# Altium schematic sheet USB_OTG.SchDoc: USB OTG
size Letter; Engineer: Nathan Petersen; DocumentNumber: 27; Revision: v1.2; SheetNumber: 27; SheetTotal: 29
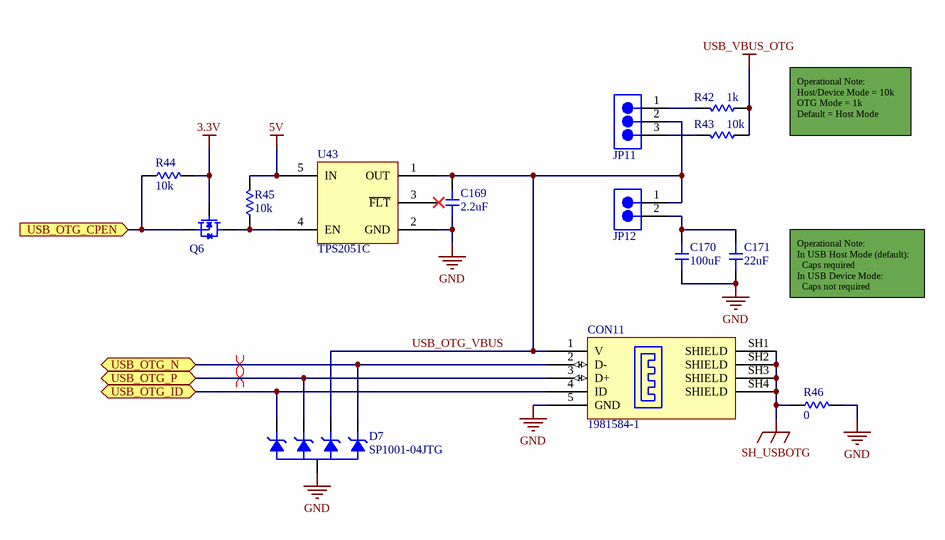
[diagram p0: USB_OTG.SchDoc]

## Parts
C169  value 2.2uF  [0603-CAP]  (hidden comment: Capacitor)
C170  value 100uF  [1812-CAP]  (hidden comment: Capacitor)
C171  value 22uF  [0603-CAP]  (hidden comment: Capacitor)
CON11  1981584-1  [1981584-1]
D7  SP1001-04JTG  [SC70-5]
JP11  Jumper3  [PIN_HEADER_1X3]  (value not drawn)
JP12  Jumper2  [PIN_HEADER_1x2]  (value not drawn)
Q6  MOSFET  [SOT95P250-3N]  (value not drawn)
R42  value 1k  [0603-RES]  (hidden comment: Resistor)
R43  value 10k  [0603-RES]  (hidden comment: Resistor)
R44  value 10k  [0603-RES]  (hidden comment: Resistor)
R45  value 10k  [0603-RES]  (hidden comment: Resistor)
R46  value 0  [0603-RES]  (hidden comment: Resistor)
U43  TPS2051C  [SOT23-5]

## Ports
USB_OTG_CPEN (in), USB_OTG_ID (bidir), USB_OTG_N (bidir), USB_OTG_P (bidir)

## Nets
3.3V: Q6.1(G) R44.2
5V: R45.2 U43.5(IN)
GND: C169.1 C170.1 C171.1 CON11.5(GND) D7.2(A) R46.2 U43.2(GND)
SH_USBOTG: CON11.SH1(SHIELD) CON11.SH2(SHIELD) CON11.SH3(SHIELD) CON11.SH4(SHIELD) R46.1
USB_VBUS_OTG: R42.1 R43.1
USB_OTG_CPEN: Q6.2(S) R44.1 ; port USB_OTG_CPEN
USB_OTG_ID: CON11.4(ID) D7.1(C1) ; port USB_OTG_ID
USB_OTG_N: CON11.2(D-) D7.4(C4) ; port USB_OTG_N
USB_OTG_P: CON11.3(D+) D7.5(C2) ; port USB_OTG_P
USB_OTG_VBUS: C169.2 CON11.1(V) D7.3(C3) JP11.2 JP12.1 U43.1(OUT)
NetC170_2: C170.2 C171.2 JP12.2
NetJP11_1: JP11.1 R42.2
NetJP11_3: JP11.3 R43.2
NetQ6_3: Q6.3(D) R45.1 U43.4(EN)

Not connected (* = marked no-connect by the designer): U43 3(~{FLT})*

## Layout directives
differential pair: USB_OTG_N, USB_OTG_P

## Notes on the sheet
- Operational Note:
  Host/Device Mode = 10k
  OTG Mode = 1k
  Default = Host Mode
- Operational Note:
  In USB Host Mode (default):
  Caps required
  In USB Device Mode:
  Caps not required
- Title:
- File:
- Sheet:
- of
- Revision:
- Time:
- Date:
- Engineer:

## Library data of the parts
C169 = Capacitor: Manufacturer: Murata; Manufacturer Part Number: GRM188R6YA225MA12D; Voltage Rating: 35V; Tolerance: 20%; Dielectric: X5R; Supplier 1: Digi-Key; Supplier Part Number 1: 490-10486-6-ND; Stock 1: 30635; Pricing 1: 1=0.21, 10=0.142, 100=0.0721, 500=0.04934, 1000=0.04364 (USD); Mount: Surface Mount; Case/Package: 0603; Weight: 0.000222oz; Case Code (Metric): 1608; Case Code (Imperial): 0603; Min Operating Temperature: -55°C; Max Operating Temperature: 85°C; Capacitance: 2.2uF; Packaging: Tape and Reel; Termination: SMD/SMT; Voltage Rating (DC): 35V; Package Quantity: 4000; Length: 0.063inch; Height: 0.8mm; Width: 0.031inch; Thickness: 0.035inch; ComponentLink1URL: http://search.murata.co.jp/Ceramy/image/img/A01X/G101/ENG/GRM188R6YA225MA12-01.pdf; ComponentLink1Description: http://search.murata.co.jp/Ceramy/image/img/A01X/G101/ENG/GRM188R6YA225MA12-01.pdf; ComponentLink2URL: http://search.murata.co.jp/Ceramy/image/img/A01X/partnumbering_e_01.pdf; ComponentLink2Description: http://search.murata.co.jp/Ceramy/image/img/A01X/partnumbering_e_01.pdf; ComponentLink3URL: http://www.mouser.com/ds/2/281/c02e-2905.pdf; ComponentLink3Description: http://www.mouser.com/ds/2/281/c02e-2905.pdf
C170 = Capacitor: Manufacturer: TDK; Manufacturer Part Number: C4532X5R1A107M280KC; Dielectric Material: Ceramic; Tolerance: 20%; Voltage Rating: 10V; Dielectric: X5R; Supplier 1: Digi-Key; Supplier Part Number 1: 445-7743-6-ND; Stock 1: 5000; Pricing 1: 1=2.2, 10=1.779, 100=1.3584 (USD); Mount: Surface Mount; Case/Package: 1812; Number of Pins: 2; Weight: 0.000952oz; Case Code (Metric): 4532; Case Code (Imperial): 1812; Min Operating Temperature: -55°C; Max Operating Temperature: 85°C; Packaging: Tape and Reel; Package Quantity: 1; Capacitance: 100uF; Voltage Rating (DC): 10V; Termination: SMD/SMT; Composition: Ceramic; Length: 4.5mm; Height: 2.5mm; Width: 0.126inch; Thickness: 0.122inch; Depth: 3.2mm; Radiation Hardening: No; REACH SVHC: No SVHC; Lead Free: Lead Free; ComponentLink1URL: https://datasheet.ciiva.com/6258/tdkmlcccaprange-6258407.pdf; ComponentLink1Description: https://datasheet.ciiva.com/6258/tdkmlcccaprange-6258407.pdf; ComponentLink2URL: https://datasheet.ciiva.com/24216/c4532x5r1a107m280kc-265401-24216024.pdf; ComponentLink2Description: https://datasheet.ciiva.com/24216/c4532x5r1a107m280kc-265401-24216024.pdf; ComponentLink3URL: https://datasheet.ciiva.com/6258/tdkmlcccaprange-6258410.pdf; ComponentLink3Description: https://datasheet.ciiva.com/6258/tdkmlcccaprange-6258410.pdf; ComponentLink4URL: https://datasheet.ciiva.com/24486/1812c4532x5r1a107m280kc-24486251.pdf; ComponentLink4Description: https://datasheet.ciiva.com/24486/1812c4532x5r1a107m280kc-24486251.pdf; ComponentLink5URL: https://datasheet.ciiva.com/6258/tdkmlcccaprange-6258413.pdf; ComponentLink5Description: https://datasheet.ciiva.com/6258/tdkmlcccaprange-6258413.pdf
C171 = Capacitor: Manufacturer: Samsung; Manufacturer Part Number: CL10A226MPCNUBE; Voltage Rating: 10V; Tolerance: 20%; Supplier 1: Digi-Key; Supplier Part Number 1: 1276-6504-6-ND; Stock 1: 30000; Pricing 1: 1=0.4, 10=0.272, 100=0.1539, 500=0.10864, 1000=0.09505 (USD); Mount: Surface Mount; Case/Package: 0603; Case Code (Metric): 1608; Case Code (Imperial): 0603; Min Operating Temperature: -55°C; Max Operating Temperature: 85°C; Packaging: Tape and Reel; Capacitance: 22uF; Length: 0.063inch; Width: 0.031inch; Thickness: 0.037inch; ComponentLink1URL: http://www.samsungsem.com/kr/support/product-search/mlcc/CL10A226MPCNUBE.jsp; ComponentLink1Description: http://www.samsungsem.com/kr/support/product-search/mlcc/CL10A226MPCNUBE.jsp; ComponentLink2URL: http://www.samsungsem.com/kr/support/library/product-catalog/mlcc.jsp; ComponentLink2Description: http://www.samsungsem.com/kr/support/library/product-catalog/mlcc.jsp
CON11 = 1981584-1: CONN RCPT MICRO USB TYPE AB; Manufacturer: TE Connectivity; Plating: Nickel,Tin; Gender: Receptacle; Voltage Rating: 30V; Current Rating: 1A; Number of Ports: 1; Number of Contacts: 5; Contact Current Rating: 1.8A; Circuit Application: Power; Connector System: Cable-to-Board; USB Standard: USB 2.0; Pitch: 0.025inch; Supplier 1: Digi-Key; Supplier Part Number 1: A97799TR-ND; Supplier 2: Digi-Key; Supplier Part Number 2: A97799DKR-ND; Manufacturer Part Number: 1981584-1; Stock 2: 5645; Pricing 2: 1=1.8, 10=1.636, 25=1.5364, 50=1.4694, 100=1.4026, 250=1.26904, 500=1.16886 (USD); Mount: Surface Mount,Horizontal; Contact Plating: Gold; Contact Material: Copper,Gold,Copper Alloy; Colour: Grey; Number of Terminals: 5; Housing Colour: Grey; Housing Material: Thermoplastic; Material: Stainless Steel; Min Operating Temperature: -30°C; Max Operating Temperature: 85°C; Termination: SMD/SMT; Orientation: Right Angle; Packaging: Tape and Reel; Package Quantity: 1000; Connector Type: Receptacle; Number of Positions: 5; Length: 8.8mm; Depth: 5.6mm; Radiation Hardening: No; ELV: Compliant; Lead Free: Lead Free; REACH SVHC: No SVHC; ComponentLink1URL: https://datasheet.ciiva.com/851/eng-cd-1981584-d1-851065.pdf; ComponentLink1Description: https://datasheet.ciiva.com/851/eng-cd-1981584-d1-851065.pdf; ComponentLink2URL: https://datasheet.ciiva.com/16668/eng-cs-1654270-2-0807-16668551.pdf; ComponentLink2Description: https://datasheet.ciiva.com/16668/eng-cs-1654270-2-0807-16668551.pdf; ComponentLink3URL: https://datasheet.ciiva.com/16312/1981584-1-16312312.pdf; ComponentLink3Description: https://datasheet.ciiva.com/16312/1981584-1-16312312.pdf; ComponentLink4URL: https://datasheet.ciiva.com/30225/eng-cs-1654270-2-0807-30225288.pdf; ComponentLink4Description: https://datasheet.ciiva.com/30225/eng-cs-1654270-2-0807-30225288.pdf; ComponentLink5URL: https://datasheet.ciiva.com/11731/0900766b80d7c578-11731289.pdf; ComponentLink5Description: https://datasheet.ciiva.com/11731/0900766b80d7c578-11731289.pdf; ComponentLink6URL: https://datasheet.ciiva.com/851/eng-cd-1981584-d2-851067.pdf; ComponentLink6Description: https://datasheet.ciiva.com/851/eng-cd-1981584-d2-851067.pdf; ComponentLink7URL: https://datasheet.ciiva.com/3094/eng-cs-1654270-2-0807-3094860.pdf; ComponentLink7Description: https://datasheet.ciiva.com/3094/eng-cs-1654270-2-0807-3094860.pdf; ComponentLink8URL: https://datasheet.ciiva.com/1098/1650952-1098190.pdf; ComponentLink8Description: https://datasheet.ciiva.com/1098/1650952-1098190.pdf
D7 = SP1001-04JTG: TVS DIODE 5.5V 13V SC70-5; Manufacturer: Littelfuse; Direction: Unidirectional; Capacitance: 8pF; Max Surge Current: 2A; Number of Channels: 4; Min Breakdown Voltage: 7V; Power Line Protection: No; Leakage Current: 500nA; Supplier 1: Digi-Key; Supplier Part Number 1: F2895TR-ND; Supplier 2: Digi-Key; Supplier Part Number 2: F2895DKR-ND; Manufacturer Part Number: SP1001-04JTG; Stock 2: 26646; Pricing 2: 1=0.62, 10=0.519, 25=0.4544, 100=0.3893, 250=0.33744, 500=0.28552, 1000=0.22063 (USD); Mount: Surface Mount; Case/Package: SC; Number of Pins: 5; Min Operating Temperature: -40°C; Max Operating Temperature: 85°C; Operating Supply Voltage: 5.5V; Packaging: Tape and Reel; Package Quantity: 3000; Polarity: Unidirectional; Breakdown Voltage: 5.5V; Clamping Voltage: 13V; Termination: SMD/SMT; Number of Unidirectional Channels: 4; Reverse Standoff Voltage: 5.5V; Working Voltage: 5.5V; Peak Pulse Current: 2A; Composition: Zener; Length: 2.25mm; Depth: 1.35mm; Radiation Hardening: No; REACH SVHC: Unknown; Lead Free: Lead Free; ComponentLink1URL: https://datasheet.ciiva.com/4510/littelfuse-spa-sp1001-0x-63620-4510770.pdf; ComponentLink1Description: https://datasheet.ciiva.com/4510/littelfuse-spa-sp1001-0x-63620-4510770.pdf; ComponentLink2URL: https://datasheet.ciiva.com/331/littelfuse-tvs-diode-array-sp1001-datasheet-pdf-331764.pdf; ComponentLink2Description: https://datasheet.ciiva.com/331/littelfuse-tvs-diode-array-sp1001-datasheet-pdf-331764.pdf; ComponentLink3URL: https://datasheet.ciiva.com/331/littelfuse-tvs-diode-array-sp1001-datasheet-pdf-331765.pdf; ComponentLink3Description: https://datasheet.ciiva.com/331/littelfuse-tvs-diode-array-sp1001-datasheet-pdf-331765.pdf; ComponentLink4URL: https://datasheet.ciiva.com/331/littelfuse-tvs-diode-array-sp1001-datasheet-pdf-331766.pdf; ComponentLink4Description: https://datasheet.ciiva.com/331/littelfuse-tvs-diode-array-sp1001-datasheet-pdf-331766.pdf; ComponentLink5URL: https://datasheet.ciiva.com/1268/littelfuse-spa-sp1001-0x-1268334.pdf; ComponentLink5Description: https://datasheet.ciiva.com/1268/littelfuse-spa-sp1001-0x-1268334.pdf
JP11 = Jumper3: Manufacturer: Wurth Electronics; Manufacturer Part Number: 61300311121; Number of Positions: 3; Gender: Male; Connector Type: Male Pin; Pitch: 0.1inch; Supplier 1: Digi-Key; Supplier Part Number 1: 732-5316-ND; Stock 1: 65953; Pricing 1: 1=0.13, 10=0.106, 25=0.088, 50=0.074, 100=0.067, 1000=0.061 (USD); Mount: Through Hole; Contact Plating: Gold; Contact Material: Copper; Colour: Black; Number of Rows: 1; Packaging: Bulk; Termination: Solder; Number of Contacts: 3; Contact Mating Length: 0.236inch; REACH SVHC: Unknown; Lead Free: Lead Free; ComponentLink1URL: http://www.farnell.com/cad/1737268.pdf; ComponentLink1Description: http://www.farnell.com/cad/1737268.pdf; ComponentLink2URL: http://katalog.we-online.de/em/datasheet/6130xx11121.pdf; ComponentLink2Description: http://katalog.we-online.de/em/datasheet/6130xx11121.pdf
JP12 = Jumper2: Manufacturer: Wurth Electronics; Manufacturer Part Number: 61300211121; Current Rating: 3A; Voltage Rating: 250V; Number of Positions: 2; Gender: Male; Connector Type: Male Pin; Pitch: 0.1inch; Supplier 1: Digi-Key; Supplier Part Number 1: 732-5315-ND; Stock 1: 95042; Pricing 1: 1=0.13, 10=0.106, 25=0.088, 50=0.074, 100=0.067, 1000=0.061 (USD); Mount: Through Hole; Contact Plating: Gold; Housing Material: PBT; Contact Material: Copper,Copper Alloy; Colour: Black; Min Operating Temperature: -40°C; Max Operating Temperature: 125°C; Number of Rows: 1; Contact Gender: Male; Packaging: Bulk; Termination: Through Hole; Number of Contacts: 2; Contact Mating Length: 0.236inch; REACH SVHC: Unknown; Lead Free: Lead Free; ComponentLink1URL: https://datasheet.ciiva.com/13619/6130xx11121-48870-13619345.pdf; ComponentLink1Description: https://datasheet.ciiva.com/13619/6130xx11121-48870-13619345.pdf
Q6 = MOSFET: Manufacturer: Diodes; Manufacturer Part Number: DMN65D8L-7; Rise Time: 2.8ns; Rds On Max: 3R; Input Capacitance: 22pF; Drain to Source Voltage (Vdss): 60V; Continuous Drain Current (ID): 310mA; Max Power Dissipation: 370mW; Drain to Source Resistance: 2R; Power Dissipation: 540mW; Turn-Off Delay Time: 12.6ns; Turn-On Delay Time: 2.7ns; Number of Elements: 1; Threshold Voltage: 2V; Element Configuration: Single; Gate to Source Voltage (Vgs): 20V; FET Type: 1 N-Channel; Supplier 1: Digi-Key; Supplier Part Number 1: DMN65D8L-7DITR-ND; Supplier 2: Digi-Key; Supplier Part Number 2: DMN65D8L-7DIDKR-ND; Stock 2: 373275; Pricing 2: 1=0.2, 10=0.179, 100=0.1173, 500=0.05732, 1000=0.03909 (USD); Mount: Surface Mount; Case/Package: SOT-23; Number of Pins: 3; Weight: 0.000282oz; Min Operating Temperature: -55°C; Max Operating Temperature: 150°C; Packaging: Tape and Reel; Package Quantity: 1; Drain to Source Breakdown Voltage: 60V; Number of Channels: 1; Length: 3mm; Height: 1.1mm; Width: 1.4mm; REACH SVHC: No SVHC; Lead Free: Lead Free; ComponentLink1URL: https://datasheet.ciiva.com/6371/dmn65d8l-6371124.pdf; ComponentLink1Description: https://datasheet.ciiva.com/6371/dmn65d8l-6371124.pdf; ComponentLink2URL: https://datasheet.ciiva.com/6371/dmn65d8l-6371126.pdf; ComponentLink2Description: https://datasheet.ciiva.com/6371/dmn65d8l-6371126.pdf; ComponentLink3URL: https://datasheet.ciiva.com/13058/dmn65d8l-219098-13058455.pdf; ComponentLink3Description: https://datasheet.ciiva.com/13058/dmn65d8l-219098-13058455.pdf; ComponentLink4URL: https://datasheet.ciiva.com/6371/dmn65d8l-6371128.pdf; ComponentLink4Description: https://datasheet.ciiva.com/6371/dmn65d8l-6371128.pdf
R42 = Resistor: Manufacturer: Panasonic; Manufacturer Part Number: ERJ-3EKF1001V; Resistance: 1kR; Tolerance: 1%; Temperature Coefficient: 100ppm/°C; Power Rating: 100mW; Voltage Rating: 75V; Supplier 1: Digi-Key; Supplier Part Number 1: P1.00KHDKR-ND; Stock 1: 16555559; Pricing 1: 1=0.1, 10=0.079, 100=0.0323, 1000=0.01449, 2500=0.01258 (USD); Mount: Surface Mount; Case/Package: 0603; Number of Pins: 2; Contact Plating: Tin; Case Code (Metric): 1608; Case Code (Imperial): 0603; Min Operating Temperature: -55°C; Max Operating Temperature: 155°C; Composition: Thick Film; Packaging: Tape and Reel; Package Quantity: 1; Number of Terminations: 2; Termination: SMD/SMT; Military Standard: Not; Max Power Dissipation: 100mW; Voltage Rating (DC): 75V; Features: Automotive AEC-Q200; Length: 1.6mm; Height: 0.45mm; Width: 0.031inch; Depth: 0.8mm; Radiation Hardening: No; REACH SVHC: No SVHC; Lead Free: Lead Free; ComponentLink1URL: https://datasheet.ciiva.com/16768/70260748-16768437.pdf; ComponentLink1Description: https://datasheet.ciiva.com/16768/70260748-16768437.pdf; ComponentLink2URL: https://datasheet.ciiva.com/16774/70260748-16774550.pdf; ComponentLink2Description: https://datasheet.ciiva.com/16774/70260748-16774550.pdf; ComponentLink3URL: https://datasheet.ciiva.com/28532/426256-28532120.pdf; ComponentLink3Description: https://datasheet.ciiva.com/28532/426256-28532120.pdf; ComponentLink4URL: https://datasheet.ciiva.com/16449/aoa0000ce2-16449065.pdf; ComponentLink4Description: https://datasheet.ciiva.com/16449/aoa0000ce2-16449065.pdf; ComponentLink5URL: https://datasheet.ciiva.com/7942/aoa0000ce2-7942427.pdf; ComponentLink5Description: https://datasheet.ciiva.com/7942/aoa0000ce2-7942427.pdf; ComponentLink6URL: https://datasheet.ciiva.com/9198/aoa0000ce2-9198923.pdf; ComponentLink6Description: https://datasheet.ciiva.com/9198/aoa0000ce2-9198923.pdf; ComponentLink7URL: https://datasheet.ciiva.com/46373/1678782-46373339.pdf; ComponentLink7Description: https://datasheet.ciiva.com/46373/1678782-46373339.pdf; ComponentLink8URL: https://datasheet.ciiva.com/48530/aoa0000ce2-48530987.pdf; ComponentLink8Description: https://datasheet.ciiva.com/48530/aoa0000ce2-48530987.pdf; ComponentLink9URL: https://datasheet.ciiva.com/46373/1678782-46373340.pdf; ComponentLink9Description: https://datasheet.ciiva.com/46373/1678782-46373340.pdf; ComponentLink10URL: https://datasheet.ciiva.com/24070/aoa0000ce2-24070269.pdf; ComponentLink10Description: https://datasheet.ciiva.com/24070/aoa0000ce2-24070269.pdf; ComponentLink11URL: https://datasheet.ciiva.com/22673/1678782-22673918.pdf; ComponentLink11Description: https://datasheet.ciiva.com/22673/1678782-22673918.pdf; ComponentLink12URL: https://datasheet.ciiva.com/30063/aoa0000ce2-30063390.pdf; ComponentLink12Description: https://datasheet.ciiva.com/30063/aoa0000ce2-30063390.pdf; ComponentLink13URL: https://datasheet.ciiva.com/17215/aoa0000ce2-17215311.pdf; ComponentLink13Description: https://datasheet.ciiva.com/17215/aoa0000ce2-17215311.pdf; Supplier 2: Digi-Key; Supplier Part Number 2: RHM1.0KDDKR-ND; Stock 2: 326754; Pricing 2: 1=0.1, 10=0.087, 100=0.0333, 1000=0.01464, 2500=0.01264 (USD); ComponentLink14URL: https://datasheet.ciiva.com/2469/esr-2469603.pdf; ComponentLink14Description: https://datasheet.ciiva.com/2469/esr-2469603.pdf; ComponentLink15URL: https://datasheet.ciiva.com/2469/esr-2469604.pdf; ComponentLink15Description: https://datasheet.ciiva.com/2469/esr-2469604.pdf; ComponentLink16URL: https://datasheet.ciiva.com/2469/esr-2469605.pdf; ComponentLink16Description: https://datasheet.ciiva.com/2469/esr-2469605.pdf
R43-R45 = Resistor: Manufacturer: Panasonic; Manufacturer Part Number: ERJ-3EKF1002V; Resistance: 10kR; Tolerance: 1%; Temperature Coefficient: 100ppm/°C; Power Rating: 100mW; Voltage Rating: 75V; Supplier 1: Digi-Key; Supplier Part Number 1: P10.0KHDKR-ND; Stock 1: 6493854; Pricing 1: 1=0.1, 10=0.079, 100=0.0323, 1000=0.01449, 2500=0.01258 (USD); Mount: Surface Mount; Case/Package: 0603; Number of Pins: 2; Contact Plating: Tin; Case Code (Metric): 1608; Case Code (Imperial): 0603; Min Operating Temperature: -55°C; Max Operating Temperature: 155°C; Composition: Thick Film; Packaging: Tape and Reel; Package Quantity: 1; Number of Terminations: 2; Termination: SMD/SMT; Military Standard: Not; Max Power Dissipation: 100mW; Voltage Rating (DC): 75V; Features: Automotive AEC-Q200; Length: 1.6mm; Height: 0.45mm; Width: 0.031inch; Depth: 0.8mm; Radiation Hardening: No; REACH SVHC: No SVHC; Lead Free: Lead Free; ComponentLink1URL: https://datasheet.ciiva.com/16511/aoa0000ce2-16511861.pdf; ComponentLink1Description: https://datasheet.ciiva.com/16511/aoa0000ce2-16511861.pdf; ComponentLink2URL: https://datasheet.ciiva.com/46372/1678782-46372725.pdf; ComponentLink2Description: https://datasheet.ciiva.com/46372/1678782-46372725.pdf; ComponentLink3URL: https://datasheet.ciiva.com/28514/426256-28514198.pdf; ComponentLink3Description: https://datasheet.ciiva.com/28514/426256-28514198.pdf; ComponentLink4URL: https://datasheet.ciiva.com/9194/aoa0000ce2-9194199.pdf; ComponentLink4Description: https://datasheet.ciiva.com/9194/aoa0000ce2-9194199.pdf; ComponentLink5URL: https://datasheet.ciiva.com/7830/aoa0000ce2-7830729.pdf; ComponentLink5Description: https://datasheet.ciiva.com/7830/aoa0000ce2-7830729.pdf; ComponentLink6URL: https://datasheet.ciiva.com/17212/aoa0000ce2-17212105.pdf; ComponentLink6Description: https://datasheet.ciiva.com/17212/aoa0000ce2-17212105.pdf; ComponentLink7URL: https://datasheet.ciiva.com/30208/aoa0000ce2-30208985.pdf; ComponentLink7Description: https://datasheet.ciiva.com/30208/aoa0000ce2-30208985.pdf; ComponentLink8URL: https://datasheet.ciiva.com/48530/aoa0000ce2-48530988.pdf; ComponentLink8Description: https://datasheet.ciiva.com/48530/aoa0000ce2-48530988.pdf; ComponentLink9URL: https://datasheet.ciiva.com/24070/aoa0000ce2-24070318.pdf; ComponentLink9Description: https://datasheet.ciiva.com/24070/aoa0000ce2-24070318.pdf; ComponentLink10URL: https://datasheet.ciiva.com/16759/70260748-16759807.pdf; ComponentLink10Description: https://datasheet.ciiva.com/16759/70260748-16759807.pdf
R46 = Resistor: Manufacturer: Panasonic; Manufacturer Part Number: ERJ-3GEY0R00V; Resistance: 0mR; Power Rating: 100mW; Voltage Rating: 75V; Tolerance: 0%; Temperature Coefficient: 600ppm/°C; Voltage Rating (DC): 50V; Supplier 1: Digi-Key; Supplier Part Number 1: P0.0GDKR-ND; Stock 1: 22482513; Pricing 1: 1=0.1, 10=0.053, 25=0.038, 50=0.029, 100=0.0214, 250=0.01632, 500=0.01306, 1000=0.00962 (USD); Mount: Surface Mount; Case/Package: 0603; Contact Plating: Tin; Case Code (Metric): 1608; Case Code (Imperial): 0603; Min Operating Temperature: -55°C; Max Operating Temperature: 155°C; Composition: Thick Film; Packaging: Tape and Reel; Package Quantity: 1; Number of Terminations: 2; Termination: SMD/SMT; Military Standard: Not; Max Power Dissipation: 100mW; Features: Automotive AEC-Q200; Length: 1.6mm; Height: 0.45mm; Width: 0.031inch; Depth: 0.8mm; Radiation Hardening: No; REACH SVHC: No SVHC; Lead Free: Lead Free; ComponentLink1URL: https://datasheet.ciiva.com/48532/aoa0000ce1-48532165.pdf; ComponentLink1Description: https://datasheet.ciiva.com/48532/aoa0000ce1-48532165.pdf; ComponentLink2URL: https://datasheet.ciiva.com/43460/1678796-43460647.pdf; ComponentLink2Description: https://datasheet.ciiva.com/43460/1678796-43460647.pdf; ComponentLink3URL: https://datasheet.ciiva.com/27055/1935748-27055113.pdf; ComponentLink3Description: https://datasheet.ciiva.com/27055/1935748-27055113.pdf; ComponentLink4URL: https://datasheet.ciiva.com/28695/1678796-28695833.pdf; ComponentLink4Description: https://datasheet.ciiva.com/28695/1678796-28695833.pdf; ComponentLink5URL: https://datasheet.ciiva.com/5959/1678796-5959707.pdf; ComponentLink5Description: https://datasheet.ciiva.com/5959/1678796-5959707.pdf; ComponentLink6URL: https://datasheet.ciiva.com/16834/aoa0000ce1-16834828.pdf; ComponentLink6Description: https://datasheet.ciiva.com/16834/aoa0000ce1-16834828.pdf; ComponentLink7URL: https://datasheet.ciiva.com/17215/aoa0000ce1-17215388.pdf; ComponentLink7Description: https://datasheet.ciiva.com/17215/aoa0000ce1-17215388.pdf; ComponentLink8URL: https://datasheet.ciiva.com/46377/1678796-46377868.pdf; ComponentLink8Description: https://datasheet.ciiva.com/46377/1678796-46377868.pdf; ComponentLink9URL: https://datasheet.ciiva.com/30199/4aoa0000ce1-30199822.pdf; ComponentLink9Description: https://datasheet.ciiva.com/30199/4aoa0000ce1-30199822.pdf; ComponentLink10URL: https://datasheet.ciiva.com/9198/aoa0000ce1-9198975.pdf; ComponentLink10Description: https://datasheet.ciiva.com/9198/aoa0000ce1-9198975.pdf; ComponentLink11URL: https://datasheet.ciiva.com/11808/0900766b80f806dd-11808207.pdf; ComponentLink11Description: https://datasheet.ciiva.com/11808/0900766b80f806dd-11808207.pdf; ComponentLink12URL: https://datasheet.ciiva.com/16758/70255313-16758527.pdf; ComponentLink12Description: https://datasheet.ciiva.com/16758/70255313-16758527.pdf
U43 = TPS2051C: IC USB PWR SW 1CH 0.5A SOT23-5; Manufacturer: Texas Instruments; Manufacturer Part Number: TPS2051CDBVT; Output Current: 500mA; Nominal Supply Current: 90uA; Number of Outputs: 1; Min Supply Voltage: 4.5V; Max Supply Voltage: 5.5V; Interface: On/Off; On-State Resistance: 97mR; Fault Protection: Over Temperature,Reverse Current; Output Configuration: High Side; Supplier 1: Digi-Key; Supplier Part Number 1: 296-29537-1-ND; Supplier 2: Digi-Key; Supplier Part Number 2: 296-29759-6-ND; Stock 2: 3902; Pricing 2: 1=1.38, 10=1.231, 100=0.9594 (USD); Mount: Surface Mount; Case/Package: SOT-23; Number of Pins: 5; Min Operating Temperature: -40°C; Max Operating Temperature: 85°C; Package Quantity: 250; Packaging: Tape and Reel; Number of Inputs: 1; Max Output Current: 500mA; Voltage: 5.5V; Current: 500mA; Length: 3.05mm; Height: 1.3mm; Width: 1.75mm; Radiation Hardening: No; REACH SVHC: No SVHC; Lead Free: Lead Free; ComponentLink1URL: https://datasheet.ciiva.com/1512/tps2051c-1512801.pdf; ComponentLink1Description: https://datasheet.ciiva.com/1512/tps2051c-1512801.pdf; ComponentLink2URL: https://datasheet.ciiva.com/3216/tps2061c-3216901.pdf; ComponentLink2Description: https://datasheet.ciiva.com/3216/tps2061c-3216901.pdf; ComponentLink3URL: https://datasheet.ciiva.com/25906/tps2061c-25906072.pdf; ComponentLink3Description: https://datasheet.ciiva.com/25906/tps2061c-25906072.pdf; ComponentLink4URL: https://datasheet.ciiva.com/1963/tps2051c-1963178.pdf; ComponentLink4Description: https://datasheet.ciiva.com/1963/tps2051c-1963178.pdf; ComponentLink5URL: https://datasheet.ciiva.com/15113/getdatasheetpartid-355784-15113930.pdf; ComponentLink5Description: https://datasheet.ciiva.com/15113/getdatasheetpartid-355784-15113930.pdf; ComponentLink6URL: https://datasheet.ciiva.com/1963/tps2051c-1963179.pdf; ComponentLink6Description: https://datasheet.ciiva.com/1963/tps2051c-1963179.pdf; ComponentLink7URL: https://datasheet.ciiva.com/1963/tps2051c-1963180.pdf; ComponentLink7Description: https://datasheet.ciiva.com/1963/tps2051c-1963180.pdf